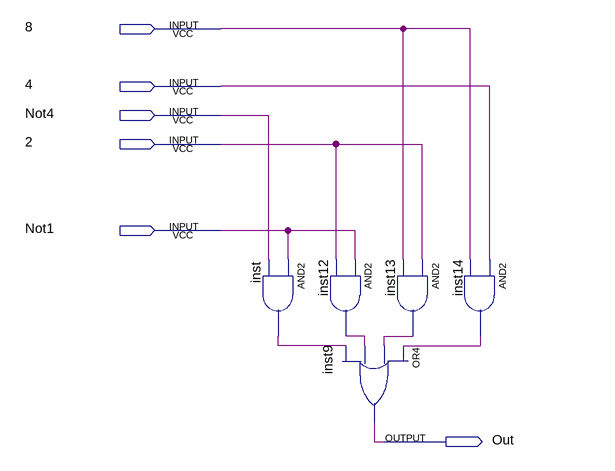
[diagram p0: schematic sheet]
// Quartus schematic E.bdf as structural Verilog: 5 symbols, 6 pins
module E (
  input  \8 ,
  input  \4 ,
  input  Not4,
  input  \2 ,
  input  Not1,
  output Out
);

  wire inst12_out, inst13_out, inst14_out, inst_out;

  and inst (inst_out, Not1, Not4);
  and inst12 (inst12_out, Not1, \2 );
  and inst13 (inst13_out, \2 , \8 );
  or inst9 (Out, inst14_out, inst13_out, inst12_out, inst_out);
  and inst14 (inst14_out, \4 , \8 );
endmodule
